# Altium schematic sheet Comparator.SchDoc
size A; SheetNumber: 3; SheetTotal: 3
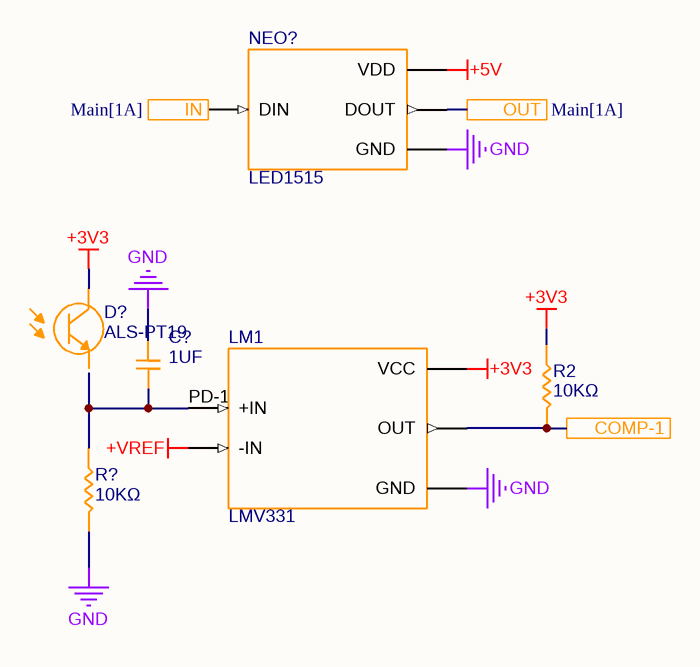
[diagram p0: Comparator.SchDoc]

## Parts
C?  1UF  [CAP_0603]
D?  ALS-PT19  [ALS-PT19]
LM1  LMV331  [LMV331]
NEO?  LED1515  [LED1515]
R2  10KΩ  [RES_0603]
R?  10KΩ  [RES_0603]

## Ports
COMP-1, IN (see Main[1A]), OUT (see Main[1A])

## Nets
+3V3: D?.C LM1.5(VCC) R2.2
+5V: NEO?.VDD
+VREF: LM1.3(-IN)
GND: C?.1 LM1.2(GND) NEO?.GND R?.1
COMP-1: LM1.4(OUT) R2.1 ; port COMP-1
IN: NEO?.DIN ; port IN
OUT: NEO?.DOUT ; port OUT
PD-1: C?.2 LM1.1(+IN) R?.2

Not connected (* = marked no-connect by the designer): D? E

## Library data of the parts
C? = CAP_0603: Capacitor SMD 0603 generic
R2 R? = RES_0603: Resistor SMD 0603 generic